# Altium project Ultrasonic Distance Sensor.PrjPcb
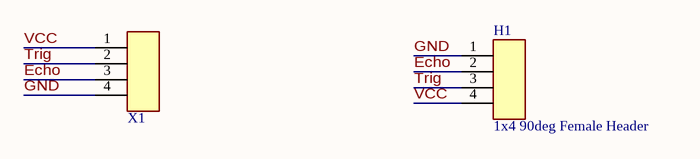
[diagram p0: Ult_Sonic_main.SchDoc]
1 sheet, 2 parts. Net scope: global (net labels, ports and power ports of the same name join across sheets).
Board file: Ult_Sonic_main.PcbDoc

## Sheet Ult_Sonic_main.SchDoc
size A; SheetNumber: 1; SheetTotal: 1

### Parts
H1  1x4 90deg Female Header  [[Header] 1x4 90deg female]
X1  [Sherlock] 90 deg 4pin  [[Sherlock] 90deg 4pin]  (value not drawn)

### Nets
Echo: H1.2 X1.3
GND: H1.1 X1.4
Trig: H1.3 X1.2
VCC: H1.4 X1.1

### Notes on the sheet
- Project/Vehicle:
- Author(s):
- -
- Revisor(s):
- Git Repo:
- Git Hash:
- Date:
- Revision:
- Size:
- A
- File:
- Sheet
- of

### Library data of the parts
H1 = [Header] 1x4 90deg Female: 2.54mm pitch
X1 = [Sherlock] 90 deg 4pin: 0353620450; Supplier 1: DigiKey; Supplier Part Number 1: WM18922-ND